# EAGLE schematic amyboard-v1.5 (EAGLE 6.1)
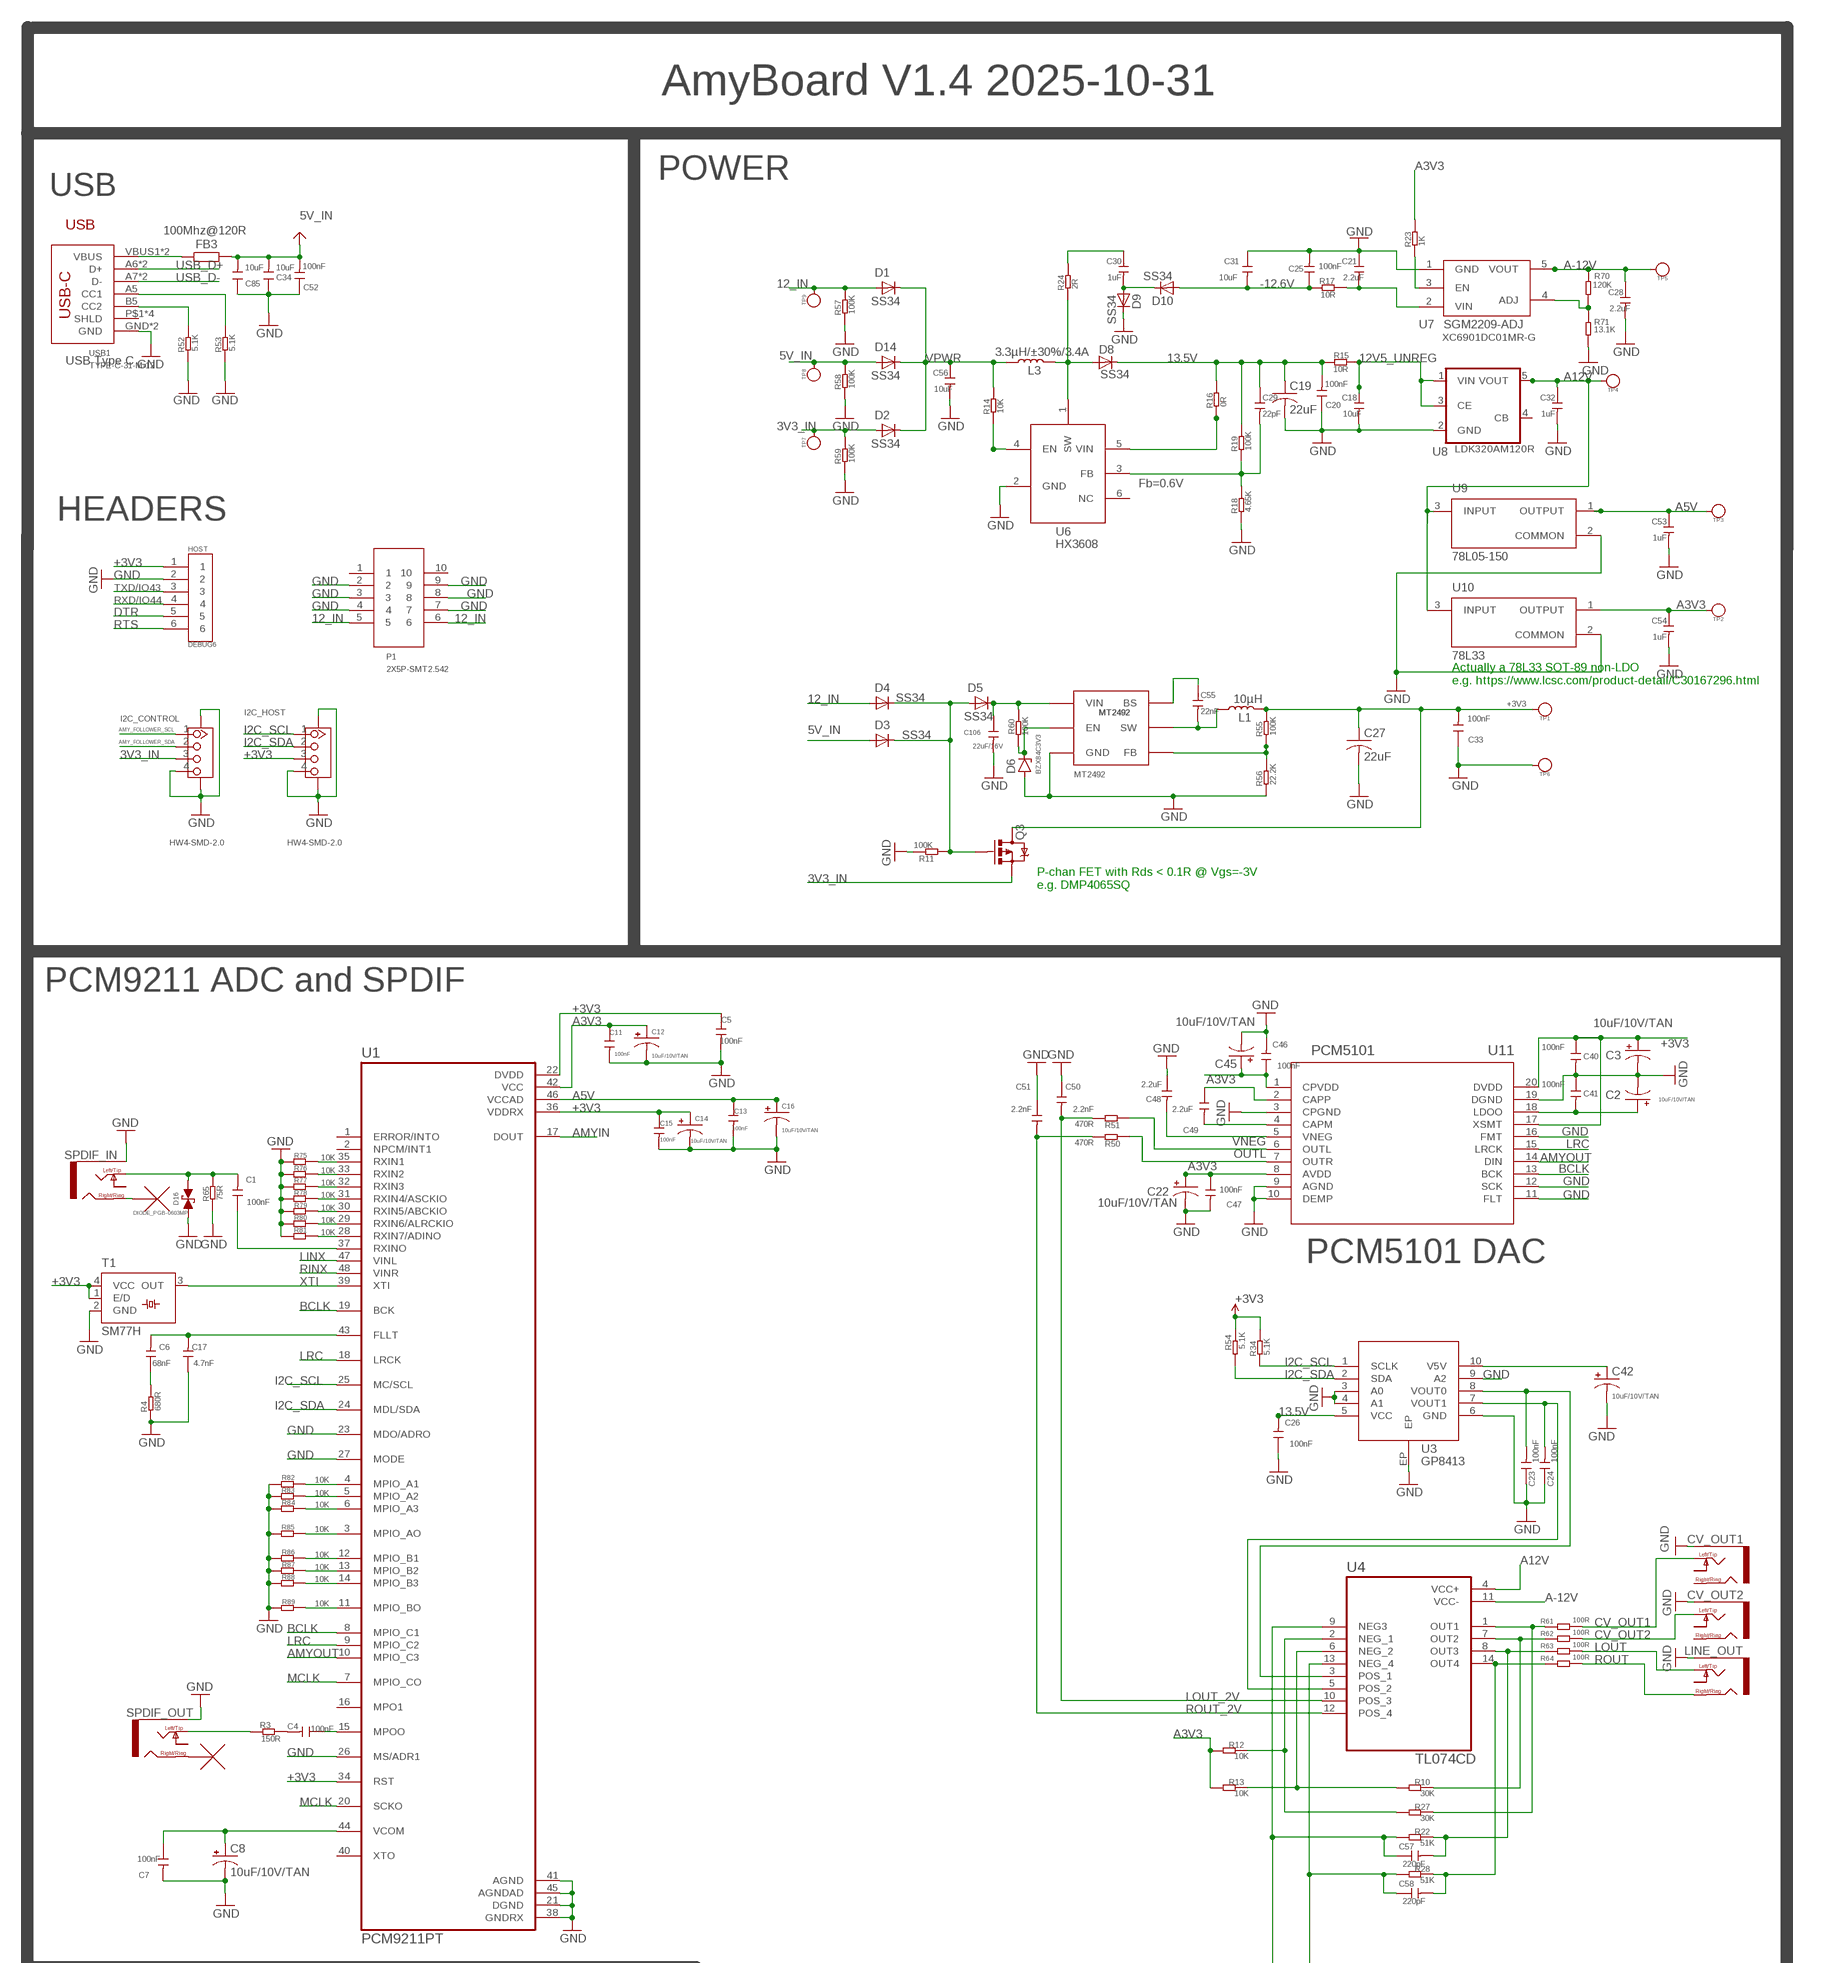
[diagram p0: schematic, sheet 1, part 1 of 2]
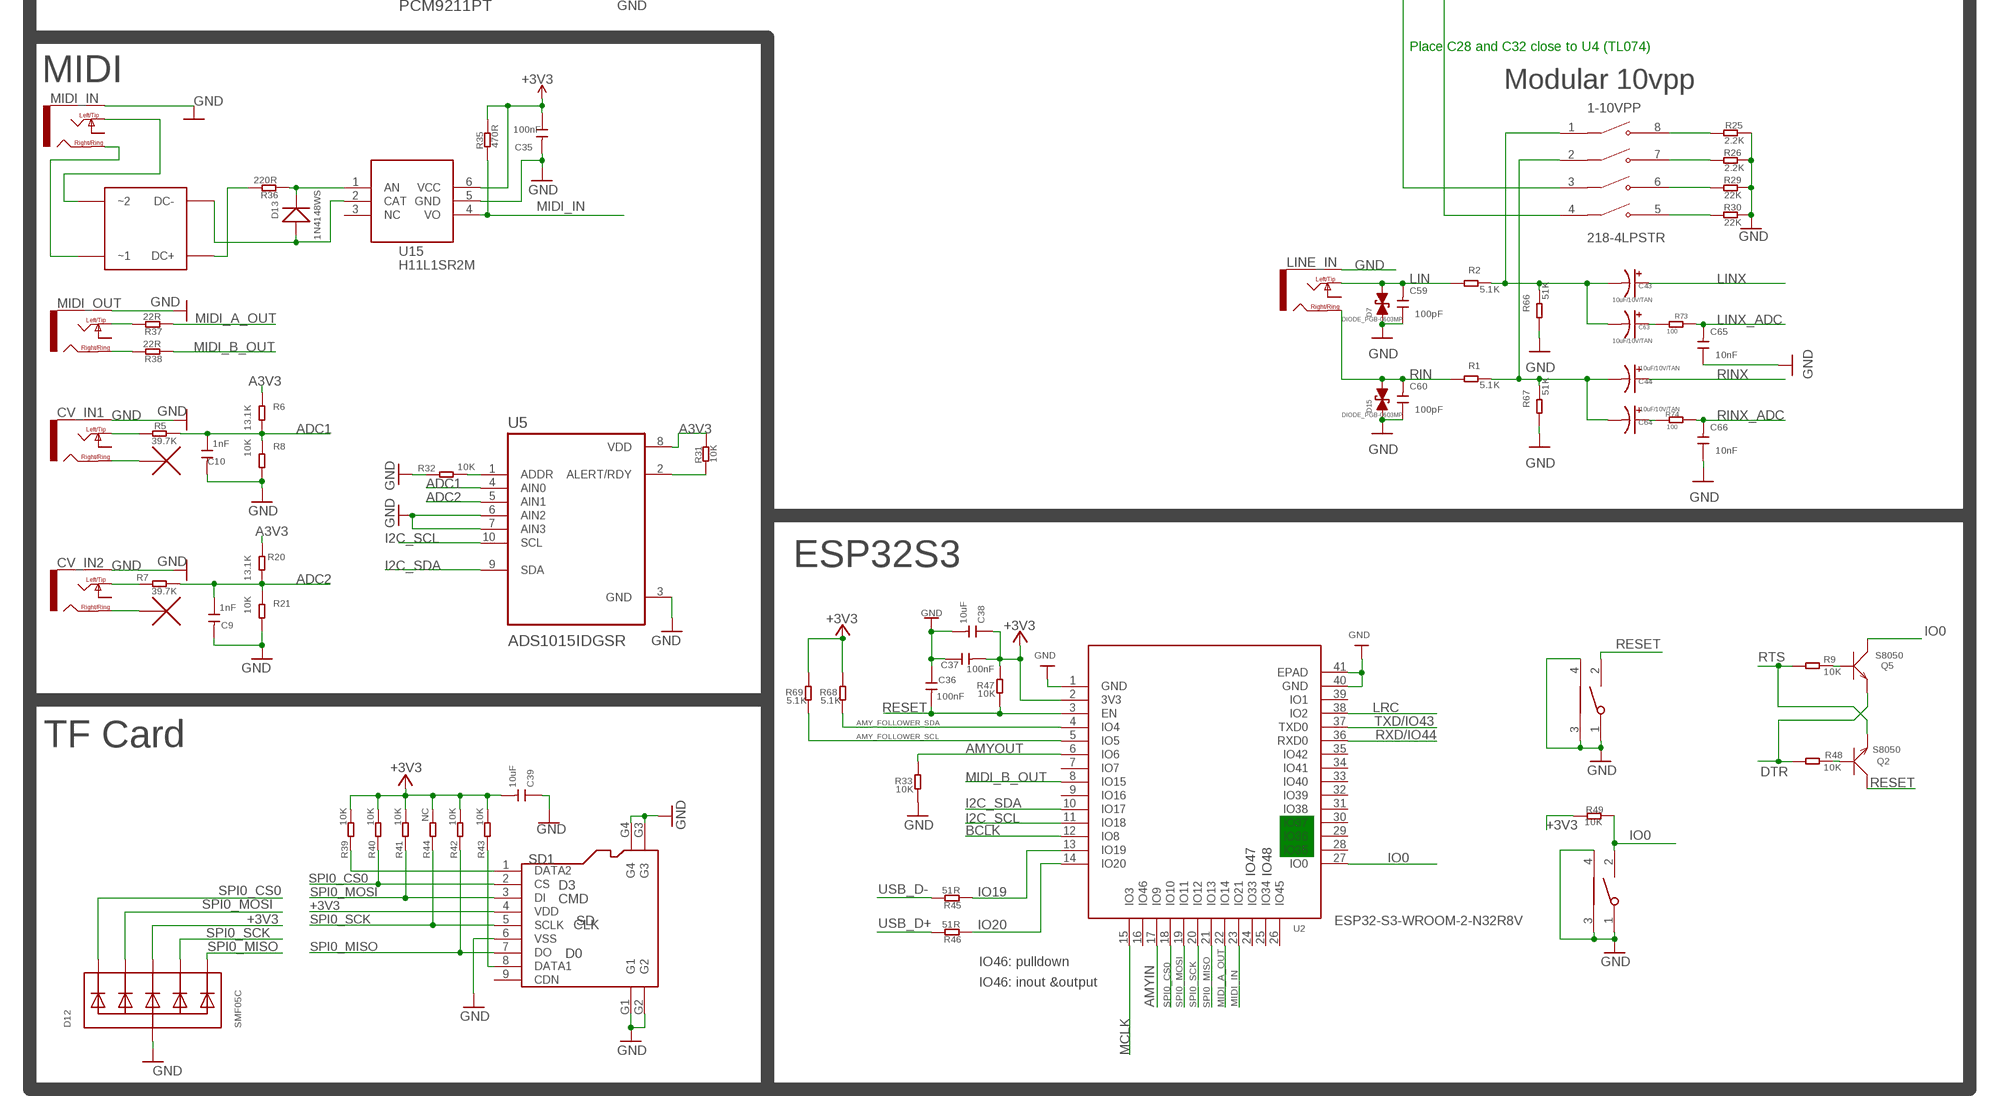
[diagram p1: schematic, sheet 1, part 2 of 2]

## Parts
1-10VPP  218-4LPSTR  [SW_218-4LPSTR]
BOOT  TS24CA  [2*4*3.5MM]
C1  100nF  DISCRETE_C-0402  [DISCRETE_C0402]
C2  10uF/10V/TAN  CPOL-USSMCZ  [SMC_Z]
C3  10uF/10V/TAN  CPOL-USSMCZ  [SMC_Z]
C4  100nF  DISCRETE_C-0402  [DISCRETE_C0402]
C5  100nF  DISCRETE_C-0402  [DISCRETE_C0402]
C6  68nF  DISCRETE_C-0402  [DISCRETE_C0402]
C7  100nF  DISCRETE_C-0402  [DISCRETE_C0402]
C8  10uF/10V/TAN  CPOL-USSMCZ  [SMC_Z]
C9  1nF  DISCRETE_C-0402  [DISCRETE_C0402]
C10  1nF  DISCRETE_C-0402  [DISCRETE_C0402]
C11  100nF  DISCRETE_C-0402  [DISCRETE_C0402]
C12  10uF/10V/TAN  CPOL-USSMCZ  [SMC_Z]
C13  100nF  DISCRETE_C-0402  [DISCRETE_C0402]
C14  10uF/10V/TAN  CPOL-USSMCZ  [SMC_Z]
C15  100nF  DISCRETE_C-0402  [DISCRETE_C0402]
C16  10uF/10V/TAN  CPOL-USSMCZ  [SMC_Z]
C17  4.7nF  DISCRETE_C-0402  [DISCRETE_C0402]
C18  10uF  CAP-0603  [C0603]
C19  22uF  C-USC1206  [C1206]
C20  100nF  DISCRETE_C-0402  [DISCRETE_C0402]
C21  2.2uF  CAP-0603  [C0603]
C22  10uF/10V/TAN  CPOL-USSMCZ  [SMC_Z]
C23  100nF  DISCRETE_C-0402  [DISCRETE_C0402]
C24  100nF  DISCRETE_C-0402  [DISCRETE_C0402]
C25  100nF  DISCRETE_C-0402  [DISCRETE_C0402]
C26  100nF  DISCRETE_C-0402  [DISCRETE_C0402]
C27  22uF  C-USC1206  [C1206]
C28  2.2uF  CAP-0603  [C0603]
C29  22pF  CAP-0603  [C0603]
C30  1uF  CAP-0603  [C0603]
C31  10uF  CAP-0603  [C0603]
C32  1uF  CAP-0603  [C0603]
C33  100nF  DISCRETE_C-0402  [DISCRETE_C0402]
C34  10uF  DISCRETE_C-0603  [DISCRETE_C0603]
C35  100nF  DISCRETE_C-0402  [DISCRETE_C0402]
C36  100nF  DISCRETE_C-0402  [DISCRETE_C0402]
C37  100nF  DISCRETE_C-0402  [DISCRETE_C0402]
C38  10uF  DISCRETE_C-0603  [DISCRETE_C0603]
C39  10uF  DISCRETE_C-0603  [DISCRETE_C0603]
C40  100nF  DISCRETE_C-0402  [DISCRETE_C0402]
C41  100nF  DISCRETE_C-0402  [DISCRETE_C0402]
C42  10uF/10V/TAN  CPOL-USSMCZ  [SMC_Z]
C43  10uF/10V/TAN  CPOL-USSMCZ  [SMC_Z]
C44  10uF/10V/TAN  CPOL-USSMCZ  [SMC_Z]
C45  10uF/10V/TAN  CPOL-USSMCZ  [SMC_Z]
C46  100nF  DISCRETE_C-0402  [DISCRETE_C0402]
C47  100nF  DISCRETE_C-0402  [DISCRETE_C0402]
C48  2.2uF  DISCRETE_C-0402  [DISCRETE_C0402]
C49  2.2uF  DISCRETE_C-0402  [DISCRETE_C0402]
C50  2.2nF  DISCRETE_C-0402  [DISCRETE_C0402]
C51  2.2nF  DISCRETE_C-0402  [DISCRETE_C0402]
C52  100nF  DISCRETE_C-0402  [DISCRETE_C0402]
C53  1uF  CAP-0603  [C0603]
C54  1uF  CAP-0603  [C0603]
C55  22nF  CAP-0603  [C0603]
C56  10uF  CAP-0603  [C0603]
C57  220pF  DISCRETE_C-0402  [DISCRETE_C0402]
C58  220pF  DISCRETE_C-0402  [DISCRETE_C0402]
C59  100pF  DISCRETE_C-0402  [DISCRETE_C0402]
C60  100pF  DISCRETE_C-0402  [DISCRETE_C0402]
C63  10uF/10V/TAN  CPOL-USSMCZ  [SMC_Z]
C64  10uF/10V/TAN  CPOL-USSMCZ  [SMC_Z]
C65  10nF  DISCRETE_C-0402  [DISCRETE_C0402]
C66  10nF  DISCRETE_C-0402  [DISCRETE_C0402]
C85  10uF  DISCRETE_C-0603  [DISCRETE_C0603]
C106  22uF/16V  C-0603  [0603]
CV_IN1  NV-PJ3410_STEREO  [NV-PJ3410_SOCKET]
CV_IN2  NV-PJ3410_STEREO  [NV-PJ3410_SOCKET]
CV_OUT1  NV-PJ3410_STEREO  [NV-PJ3410_SOCKET]
CV_OUT2  NV-PJ3410_STEREO  [NV-PJ3410_SOCKET]
D1  SS34  DIODE-DO-214AC  [DO-214AC]
D2  SS34  DIODE-DO-214AC  [DO-214AC]
D3  SS34  DIODE-DO-214AC  [DO-214AC]
D4  SS34  DIODE-DO-214AC  [DO-214AC]
D5  SS34  DIODE-DO-214AC  [DO-214AC]
D6  BZX84C3V3  BZX84CSMD  [TO236]
D7  DIODE_PGB-0603MP  [DIODE_PGB-0603MP]
D8  SS34  DIODE-DO-214AC  [DO-214AC]
D9  SS34  DIODE-DO-214AC  [DO-214AC]
D10  SS34  DIODE-DO-214AC  [DO-214AC]
D12  SMF05C  TVSARRAY_5LANE  [SOT363]
D13  1N4148WS  D'0805'  [SOD323]
D14  SS34  DIODE-DO-214AC  [DO-214AC]
D15  DIODE_PGB-0603MP  [DIODE_PGB-0603MP]
D16  DIODE_PGB-0603MP  [DIODE_PGB-0603MP]
FB3  100Mhz@120R  R-EU_R0805  [R0805]
HOST  DEBUG6  [DEBUG*6]
I2C_CONTROL  HW4-SMD-2.0  GROVE-CONNECTOR-SMD'90D'  [HW4-SMD-2.0-90D]
I2C_HOST  HW4-SMD-2.0  GROVE-CONNECTOR-SMD'90D'  [HW4-SMD-2.0-90D]
L1  10µH  INDUCTOR-CR54-3.3UH  [CR54]
L3  3.3µH/±30%/3.4A  INDUCTOR-CR54-3.3UH  [CR54]
LINE_IN  NV-PJ3410_STEREO  [NV-PJ3410_SOCKET]
LINE_OUT  NV-PJ3410_STEREO  [NV-PJ3410_SOCKET]
MB14F  MB14F  [MBF]
MIDI_IN  NV-PJ3410_STEREO  [NV-PJ3410_SOCKET]
MIDI_OUT  NV-PJ3410_STEREO  [NV-PJ3410_SOCKET]
P1  2X5P-SMT2.542  [2*5P-SMT2.54-HORN]
PCM5101  U11  PCM5101APW  [PW20_TEX]
Q2  S8050  TRANSISTOR-NPN-SOT23  [SOT23]
Q3  DMP4065SQ  MOSFET-PCHANNEL  [SOT23-3]
Q5  S8050  TRANSISTOR-NPN-SOT23  [SOT23]
R1  5.1K  DISCRETE_R-0402  [DISCRETE_R0402]
R2  5.1K  DISCRETE_R-0402  [DISCRETE_R0402]
R3  150R  DISCRETE_R-0402  [DISCRETE_R0402]
R4  680R  DISCRETE_R-0402  [DISCRETE_R0402]
R5  39.7K  DISCRETE_R-0402  [DISCRETE_R0402]
R6  13.1K  DISCRETE_R-0402  [DISCRETE_R0402]
R7  39.7K  DISCRETE_R-0402  [DISCRETE_R0402]
R8  10K  DISCRETE_R-0402  [DISCRETE_R0402]
R9  10K  DISCRETE_R-0402  [DISCRETE_R0402]
R10  30K  DISCRETE_R-0402  [DISCRETE_R0402]
R11  100K  DISCRETE_R-0402  [DISCRETE_R0402]
R12  10K  DISCRETE_R-0402  [DISCRETE_R0402]
R13  10K  DISCRETE_R-0402  [DISCRETE_R0402]
R14  10K  DISCRETE_R-0402  [DISCRETE_R0402]
R15  10R  R-0603  [R0603]
R16  0R  DISCRETE_R-0402  [DISCRETE_R0402]
R17  10R  DISCRETE_R-0402  [DISCRETE_R0402]
R18  4.65K  DISCRETE_R-0402  [DISCRETE_R0402]
R19  100K  DISCRETE_R-0402  [DISCRETE_R0402]
R20  13.1K  DISCRETE_R-0402  [DISCRETE_R0402]
R21  10K  DISCRETE_R-0402  [DISCRETE_R0402]
R22  51K  DISCRETE_R-0402  [DISCRETE_R0402]
R23  1K  DISCRETE_R-0402  [DISCRETE_R0402]
R24  2R  DISCRETE_R-0402  [DISCRETE_R0402]
R25  2.2K  DISCRETE_R-0402  [DISCRETE_R0402]
R26  2.2K  DISCRETE_R-0402  [DISCRETE_R0402]
R27  30K  DISCRETE_R-0402  [DISCRETE_R0402]
R28  51K  DISCRETE_R-0402  [DISCRETE_R0402]
R29  22K  DISCRETE_R-0402  [DISCRETE_R0402]
R30  22K  DISCRETE_R-0402  [DISCRETE_R0402]
R31  10K  DISCRETE_R-0402  [DISCRETE_R0402]
R32  10K  DISCRETE_R-0402  [DISCRETE_R0402]
R33  10K  DISCRETE_R-0402  [DISCRETE_R0402]
R34  5.1K  DISCRETE_R-0402  [DISCRETE_R0402]
R35  470R  DISCRETE_R-0402  [DISCRETE_R0402]
R36  220R  DISCRETE_R-0402  [DISCRETE_R0402]
R37  22R  DISCRETE_R-0402  [DISCRETE_R0402]
R38  22R  DISCRETE_R-0402  [DISCRETE_R0402]
R39  10K  DISCRETE_R-0402  [DISCRETE_R0402]
R40  10K  DISCRETE_R-0402  [DISCRETE_R0402]
R41  10K  DISCRETE_R-0402  [DISCRETE_R0402]
R42  10K  DISCRETE_R-0402  [DISCRETE_R0402]
R43  10K  DISCRETE_R-0402  [DISCRETE_R0402]
R44  NC  DISCRETE_R-0402  [DISCRETE_R0402]
R45  51R  DISCRETE_R-0402  [DISCRETE_R0402]
R46  51R  DISCRETE_R-0402  [DISCRETE_R0402]
R47  10K  DISCRETE_R-0402  [DISCRETE_R0402]
R48  10K  DISCRETE_R-0402  [DISCRETE_R0402]
R49  10K  DISCRETE_R-0402  [DISCRETE_R0402]
R50  470R  DISCRETE_R-0402  [DISCRETE_R0402]
R51  470R  DISCRETE_R-0402  [DISCRETE_R0402]
R52  5.1K  DISCRETE_R-0402  [DISCRETE_R0402]
R53  5.1K  DISCRETE_R-0402  [DISCRETE_R0402]
R54  5.1K  DISCRETE_R-0402  [DISCRETE_R0402]
R55  100K  DISCRETE_R-0402  [DISCRETE_R0402]
R56  22.2K  DISCRETE_R-0402  [DISCRETE_R0402]
R57  100K  DISCRETE_R-0402  [DISCRETE_R0402]
R58  100K  DISCRETE_R-0402  [DISCRETE_R0402]
R59  100K  DISCRETE_R-0402  [DISCRETE_R0402]
R60  100K  DISCRETE_R-0402  [DISCRETE_R0402]
R61  100R  DISCRETE_R-0402  [DISCRETE_R0402]
R62  100R  DISCRETE_R-0402  [DISCRETE_R0402]
R63  100R  DISCRETE_R-0402  [DISCRETE_R0402]
R64  100R  DISCRETE_R-0402  [DISCRETE_R0402]
R65  75R  DISCRETE_R-0402  [DISCRETE_R0402]
R66  51K  DISCRETE_R-0402  [DISCRETE_R0402]
R67  51K  DISCRETE_R-0402  [DISCRETE_R0402]
R68  5.1K  DISCRETE_R-0402  [DISCRETE_R0402]
R69  5.1K  DISCRETE_R-0402  [DISCRETE_R0402]
R70  120K  DISCRETE_R-0402  [DISCRETE_R0402]
R71  13.1K  DISCRETE_R-0402  [DISCRETE_R0402]
R73  100  DISCRETE_R-0402  [DISCRETE_R0402]
R74  100  DISCRETE_R-0402  [DISCRETE_R0402]
R75  10K  DISCRETE_R-0402  [DISCRETE_R0402]
R76  10K  DISCRETE_R-0402  [DISCRETE_R0402]
R77  10K  DISCRETE_R-0402  [DISCRETE_R0402]
R78  10K  DISCRETE_R-0402  [DISCRETE_R0402]
R79  10K  DISCRETE_R-0402  [DISCRETE_R0402]
R80  10K  DISCRETE_R-0402  [DISCRETE_R0402]
R81  10K  DISCRETE_R-0402  [DISCRETE_R0402]
R82  10K  DISCRETE_R-0402  [DISCRETE_R0402]
R83  10K  DISCRETE_R-0402  [DISCRETE_R0402]
R84  10K  DISCRETE_R-0402  [DISCRETE_R0402]
R85  10K  DISCRETE_R-0402  [DISCRETE_R0402]
R86  10K  DISCRETE_R-0402  [DISCRETE_R0402]
R87  10K  DISCRETE_R-0402  [DISCRETE_R0402]
R88  10K  DISCRETE_R-0402  [DISCRETE_R0402]
R89  10K  DISCRETE_R-0402  [DISCRETE_R0402]
RST  TS24CA  [2*4*3.5MM]
SD1  SD  HOLDER-MICROSD-9P  [9P-SMD-W/-RING]
SPDIF_IN  NV-PJ3410_STEREO  [NV-PJ3410_SOCKET]
SPDIF_OUT  NV-PJ3410_STEREO  [NV-PJ3410_SOCKET]
T1  SM77H  [SM77H]
TP1  PAD-TEST-POINT-CIRCLE'3535'  [TP_3535]
TP2  PAD-TEST-POINT-CIRCLE'3535'  [TP_3535]
TP3  PAD-TEST-POINT-CIRCLE'3535'  [TP_3535]
TP4  PAD-TEST-POINT-CIRCLE'3535'  [TP_3535]
TP5  PAD-TEST-POINT-CIRCLE'3535'  [TP_3535]
TP6  PAD-TEST-POINT-CIRCLE'3535'  [TP_3535]
TP7  PAD-TEST-POINT-CIRCLE'3535'  [TP_3535]
TP8  PAD-TEST-POINT-CIRCLE'3535'  [TP_3535]
TP9  PAD-TEST-POINT-CIRCLE'3535'  [TP_3535]
U1  PCM9211PT  [QFP50P900X900X160-48N]
U2  ESP32­S2­SOLO  [ESP32-­S2-­SOLO]
U3  GP8413  [ESOP-10-EP-150MIL]
U4  TL074CD  [SOIC127P600X175-14N]
U5  ADS1015IDGSR  [SOP50P490X110-10N]
U6  HX3608  [SOT-23-6]
U7  SGM2209-ADJ  [SOT-25]
U8  TS5205  [SOT25]
U9  78L05-150  UA78L05ACPKG4  [VREG_UA78L05ACPKG4]
U10  78L33  UA78L05ACPKG4  [VREG_UA78L05ACPKG4]
U12  MT2492  [SOT23-6]
U15  H11L1SR2M  [SOP-6-2.54MM]
U$1  NC_MARKER  (no package)
U$2  NC_MARKER  (no package)
U$5  NC_MARKER  (no package)
U$6  NC_MARKER  (no package)
USB1  TYPE-C-31-M-12  [TYPE-C-31-M-12]

## Nets
3V3_IN: D2.A I2C_CONTROL.3 Q3.2(S) R59.1 TP7.T
5V_IN: C34.2 C52.2 C85.2 D3.A D14.A FB3.2 R58.1 TP8.T ; supply symbol labelled VBUS
12_IN: D1.A D4.A P1.5 P1.6 R57.1 TP9.T
12V5_UNREG: C18.1 R15.1 U8.1(VIN) U8.3(CE)
13.5V: C19.1 C20.2 C26.2 C29.1 D8.C R15.2 R16.1 R19.1 U3.5(VCC)
+3V3: C3.+ C5.1 C14.+ C15.1 C27.1 C33.2 C35.1 C37.2 C38.1 C39.2 C40.1 D12.4(C3) HOST.1 I2C_HOST.3 L1.P$2 PCM5101.17(XSMT) PCM5101.20(DVDD) Q3.3(D) R34.1 R35.1 R39.2 R40.2 R41.2 R42.2 R43.2 R44.2 R47.2 R49.2 R54.1 R55.1 R68.2 R69.2 SD1.4(VDD) T1.1(E/D) T1.4(VCC) TP1.T U1.22(DVDD) U1.34(RST) U1.36(VDDRX) U2.2(3V3) U15.6(VCC)
-12.6V: C25.1 C31.2 D10.A R17.2
A3V3: C11.1 C12.+ C22.+ C45.+ C46.1 C47.1 C54.1 PCM5101.1(CPVDD) PCM5101.8(AVDD) R6.2 R12.2 R13.2 R20.2 R23.1 R31.1 TP2.T U1.42(VCC) U5.8(VDD) U10.1(OUTPUT)
A5V: C13.1 C16.+ C53.1 TP3.T U1.46(VCCAD) U9.1(OUTPUT)
A12V: C32.1 TP4.T U4.4(VCC+) U8.5(VOUT) U9.3(INPUT) U10.3(INPUT)
A-12V: C28.1 R70.1 TP5.T U4.11(VCC-) U7.5(VOUT)
ADC1: C10.1 R5.1 R6.1 R8.2 U5.4(AIN0)
ADC2: C9.1 R7.1 R20.1 R21.2 U5.5(AIN1)
AMY_FOLLOWER_SCL: I2C_CONTROL.1 R69.1 U2.5(IO5)
AMY_FOLLOWER_SDA: I2C_CONTROL.2 R68.1 U2.4(IO4)
AMYIN: U1.17(DOUT) U2.17(IO9)
AMYOUT: PCM5101.14(DIN) R33.2 U1.10(MPIO_C3) U2.6(IO6)
BCLK: PCM5101.13(BCK) U1.8(MPIO_C1) U1.19(BCK) U2.12(IO8)
CV_OUT1: CV_OUT1.LEFT/TIP(TIP) R61.1
CV_OUT2: CV_OUT2.LEFT/TIP(TIP) R62.1
DTR: HOST.5 Q5.2(E) R48.2
ENABLE: R14.2 U6.4(EN)
GND: BOOT.1 BOOT.3 BOOT.4 C2.- C3.- C5.2 C7.2 C8.- C9.2 C10.2 C11.2 C12.- C13.2 C14.- C15.2 C16.- C17.1 C18.2 C19.2 C20.1 C21.1 C22.- C23.1 C24.1 C25.2 C26.1 C27.2 C28.2 C31.1 C32.2 C33.1 C34.1 C35.2 C36.1 C37.1 C38.2 C39.1 C40.2 C41.1 C42.- C45.- C46.2 C47.2 C48.1 C50.1 C51.1 C52.1 C53.2 C54.2 C56.2 C59.1 C60.1 C65.1 C66.1 C85.1 C106.2 CV_IN1.GND(EARTH) CV_IN2.GND(EARTH) CV_OUT1.GND(EARTH) CV_OUT2.GND(EARTH) D6.A D7.1 D9.C D12.2(A) D15.1 D16.1 HOST.2 I2C_CONTROL.4 I2C_CONTROL.SS1 I2C_CONTROL.SS2 I2C_HOST.4 I2C_HOST.SS1 I2C_HOST.SS2 LINE_IN.GND(EARTH) LINE_OUT.GND(EARTH) MIDI_IN.GND(EARTH) MIDI_OUT.GND(EARTH) P1.2 P1.3 P1.4 P1.7 P1.8 P1.9 PCM5101.3(CPGND) PCM5101.9(AGND) PCM5101.10(DEMP) PCM5101.11(FLT) PCM5101.12(SCK) PCM5101.16(FMT) PCM5101.19(DGND) R4.2 R8.1 R11.1 R18.2 R21.1 R25.1 R26.1 R29.1 R30.1 R32.1 R33.1 R52.2 R53.2 R56.2 R57.2 R58.2 R59.2 R65.2 R66.2 R67.2 R71.2 R75.2 R76.2 R77.2 R78.2 R79.2 R80.2 R81.2 R82.2 R83.2 R84.2 R85.2 R86.2 R87.2 R88.2 R89.2 RST.1 RST.3 RST.4 SD1.6(VSS) SD1.G1 SD1.G2 SD1.G3 SD1.G4 SPDIF_IN.GND(EARTH) SPDIF_OUT.GND(EARTH) T1.2(GND) TP6.T U1.21(DGND) U1.23(MDO/ADRO) U1.26(MS/ADR1) U1.27(MODE) U1.38(GNDRX) U1.41(AGND) U1.45(AGNDAD) U2.1(GND) U2.40(GND) U2.41(EPAD) U3.3(A0) U3.4(A1) U3.6(GND) U3.9(A2) U3.EP U5.3(GND) U5.6(AIN2) U5.7(AIN3) U6.2(GND) U7.1(GND) U8.2(GND) U9.2(COMMON) U10.2(COMMON) U12.2(GND) U15.5(GND) USB1.GND USB1.GND2(GND)
I2C_SCL: I2C_HOST.1 R34.2 U1.25(MC/SCL) U2.11(IO18) U3.1(SCLK) U5.10(SCL)
I2C_SDA: I2C_HOST.2 R54.2 U1.24(MDL/SDA) U2.10(IO17) U3.2(SDA) U5.9(SDA)
IO0: BOOT.2 Q5.3(C) R49.1 U2.27(IO0)
IO19: R45.2 U2.13(IO19)
IO20: R46.2 U2.14(IO20)
LIN: C59.2 D7.2 LINE_IN.LEFT/TIP(TIP) R2.2
LINX: C43.+ U1.47(VINL)
LINX_ADC: C65.2 R73.1
LOUT: LINE_OUT.LEFT/TIP(TIP) R63.1
LOUT_2V: C50.2 R51.1 U4.10(POS_3)
LRC: PCM5101.15(LRCK) U1.9(MPIO_C2) U1.18(LRCK) U2.38(IO2)
MCLK: U1.7(MPIO_CO) U1.20(SCKO) U2.15(IO3)
MIDI_A_OUT: R37.2 U2.22(IO14)
MIDI_B_OUT: R38.2 U2.8(IO15)
MIDI_IN: R35.2 U2.23(IO21) U15.4(VO)
N$1: C1.1 U1.37(RXINO)
N$2: C4.2 R3.1
N$3: C4.1 U1.15(MPOO)
N$4: 1-10VPP.1 C43.- C63.- R2.1 R66.1
N$5: 1-10VPP.2 C44.- C64.- R1.1 R67.1
N$6: C7.1 C8.+ U1.44(VCOM)
N$7: C6.2 C17.2 U1.43(FLLT)
N$8: C6.1 R4.1
N$9: SPDIF_OUT.RIGHT/RING(RING) U$1.P$1
N$10: SPDIF_IN.RIGHT/RING(RING) U$2.P$1
N$11: R70.2 R71.1 U7.4(ADJ)
N$13: CV_IN2.LEFT/TIP(TIP) R7.2
N$14: CV_IN2.RIGHT/RING(RING) U$6.P$1
N$15: C21.2 R17.1 U7.2(VIN)
N$16: D13.+ MB14F.DCMINUS(DC-) U15.2(CAT)
N$17: CV_IN1.RIGHT/RING(RING) U$5.P$1
N$18: C23.2 U3.8(VOUT0) U4.3(POS_1)
N$19: CV_IN1.LEFT/TIP(TIP) R5.2
N$20: C24.2 U3.7(VOUT1) U4.5(POS_2)
N$21: D8.A L3.P$2 R24.2 U6.1(SW)
N$22: C42.+ U3.10(V5V)
N$23: D3.C D4.C D5.A Q3.1(G) R11.2
N$24: C106.1 D5.C R60.1 U12.5(VIN)
N$25: C55.2 L1.P$1 U12.6(SW)
N$26: R10.1 R62.2 U4.7(OUT2)
N$27: C30.1 R24.1
N$28: R16.2 U6.5(VIN)
N$29: C30.2 D9.A D10.C
N$30: R23.2 U7.3(EN)
N$31: R10.2 R13.1 U4.6(NEG_2)
N$32: R27.1 R61.2 U4.1(OUT1)
N$33: R12.1 R27.2 U4.2(NEG_1)
N$34: Q2.1(B) R48.1
N$35: 1-10VPP.5 R30.2
N$36: 1-10VPP.6 R29.2
N$37: Q5.1(B) R9.1
N$38: R53.1 USB1.A5(CC1)
N$39: R52.1 USB1.B5(CC2)
N$40: 1-10VPP.8 R25.2
N$41: 1-10VPP.7 R26.2
N$42: FB3.1 USB1.VBUS1(VBUS) USB1.VBUS2(VBUS)
N$43: R31.2 U5.2(ALERT/RDY)
N$44: 1-10VPP.3 C57.1 R22.2 U4.9(NEG3)
N$45: 1-10VPP.4 C58.1 R28.2 U4.13(NEG_4)
N$46: R32.2 U5.1(ADDR)
N$47: R55.2 R56.1 U12.3(FB)
N$48: C2.+ C41.2 PCM5101.18(LDOO)
N$49: MB14F.DCPLUS(DC+) R36.1
N$50: PCM5101.7(OUTR) R50.2
N$51: C49.2 PCM5101.4(CAPM)
N$52: C49.1 PCM5101.2(CAPP)
N$53: C55.1 U12.1(BS)
N$54: MB14F.AC1(~1) MIDI_IN.RIGHT/RING(RING)
N$55: MB14F.AC2(~2) MIDI_IN.LEFT/TIP(TIP)
N$56: D6.C R60.2 U12.4(EN)
N$57: D13.- R36.2 U15.1(AN)
N$58: MIDI_OUT.LEFT/TIP(TIP) R37.1
N$59: MIDI_OUT.RIGHT/RING(RING) R38.1
N$60: C29.2 R18.1 R19.2 U6.3(FB)
N$61: C58.2 R28.1 R64.2 U4.14(OUT4)
N$63: C57.2 R22.1 R63.2 U4.8(OUT3)
N$67: R75.1 U1.35(RXIN1)
N$68: R76.1 U1.33(RXIN2)
N$69: C63.+ R73.2
N$70: C64.+ R74.2
N$75: R39.1 SD1.1(DATA2)
N$76: R77.1 U1.32(RXIN3)
N$77: R43.1 SD1.8(DATA1)
N$78: R78.1 U1.31(RXIN4/ASCKIO)
N$79: R79.1 U1.30(RXIN5/ABCKIO)
N$80: R80.1 U1.29(RXIN6/ALRCKIO)
N$81: R81.1 U1.28(RXIN7/ADINO)
N$82: R82.1 U1.4(MPIO_A1)
N$83: R83.1 U1.5(MPIO_A2)
N$84: R84.1 U1.6(MPIO_A3)
N$85: R85.1 U1.3(MPIO_AO)
N$86: R86.1 U1.12(MPIO_B1)
N$87: R87.1 U1.13(MPIO_B2)
N$88: R88.1 U1.14(MPIO_B3)
N$89: R89.1 U1.11(MPIO_BO)
OUTL: PCM5101.6(OUTL) R51.2
RESET: C36.2 Q2.3(C) R47.1 RST.2 U2.3(EN)
RIN: C60.2 D15.2 LINE_IN.RIGHT/RING(RING) R1.2
RINX: C44.+ U1.48(VINR)
RINX_ADC: C66.2 R74.1
ROUT: LINE_OUT.RIGHT/RING(RING) R64.1
ROUT_2V: C51.2 R50.1 U4.12(POS_4)
RTS: HOST.6 Q2.2(E) R9.2
RXD/IO44: HOST.4 U2.36(RXD0)
SPDIFIN_SIGNAL: C1.2 D16.2 R65.1 SPDIF_IN.LEFT/TIP(TIP)
SPDIFOUT_SIGNAL: R3.2 SPDIF_OUT.LEFT/TIP(TIP)
SPI0_CS0: D12.1(C1) R40.1 SD1.2(CS) U2.18(IO10)
SPI0_MISO: D12.6(C5) R42.1 SD1.7(DO) U2.21(IO13)
SPI0_MOSI: D12.3(C2) R41.1 SD1.3(DI) U2.19(IO11)
SPI0_SCK: D12.5(C4) R44.1 SD1.5(SCLK) U2.20(IO12)
TXD/IO43: HOST.3 U2.37(TXD0)
USB_D+: R46.1 USB1.A6(D+) USB1.B6(D+)
USB_D-: R45.1 USB1.A7(D-) USB1.B7(D-)
VNEG: C48.2 PCM5101.5(VNEG)
VPWR: C56.1 D1.C D2.C D14.C L3.P$1 R14.1
XTI: T1.3(OUT) U1.39(XTI)
Unconnected: CV_IN1.SWITCH(TIP-NORM) CV_IN2.SWITCH(TIP-NORM) CV_OUT1.RIGHT/RING(RING) CV_OUT1.SWITCH(TIP-NORM) CV_OUT2.RIGHT/RING(RING) CV_OUT2.SWITCH(TIP-NORM) LINE_IN.SWITCH(TIP-NORM) LINE_OUT.SWITCH(TIP-NORM) MIDI_IN.SWITCH(TIP-NORM) MIDI_OUT.SWITCH(TIP-NORM) P1.1 P1.10 SD1.9(CDN) SPDIF_IN.SWITCH(TIP-NORM) SPDIF_OUT.SWITCH(TIP-NORM) U1.1(ERROR/INTO) U1.2(NPCM/INT1) U1.16(MPO1) U1.40(XTO) U2.7(IO7) U2.9(IO16) U2.16(IO46) U2.24(IO33) U2.25(IO34) U2.26(IO45) U2.28(IO35) U2.29(IO36) U2.30(IO37) U2.31(IO38) U2.32(IO39) U2.33(IO40) U2.34(IO41) U2.35(IO42) U2.39(IO1) U6.6(NC) U8.4(CB) U15.3(NC) USB1.P$1(SHLD) USB1.P$2(SHLD) USB1.P$3(SHLD) USB1.P$4(SHLD)

## Notes on the sheet
- AmyBoard V1.4 2025-10-31
- POWER
- USB
- USB
- XC6901DC01MR-G
- USB Type C
- LDK320AM120R
- Fb=0.6V
- HEADERS
- Actually a 78L33 SOT-89 non-LDO 
  e.g. https://www.lcsc.com/product-detail/C30167296.html
- P-chan FET with Rds < 0.1R @ Vgs=-3V
  e.g. DMP4065SQ
- PCM9211 ADC and SPDIF
- PCM5101 DAC
- Place C28 and C32 close to U4 (TL074)
- MIDI | Modular 10vpp
- ESP32S3
- TF Card
- IO47 | IO48
- D3
- CMD
- ESP32-S3-WROOM-2-N32R8V
- CLK
- D0
- IO46: pulldown
- IO46: inout &output

## Library data of the parts
1-10VPP = 218-4LPSTR:218-4LPSTR: Check availability <https://pricing.snapeda.com/parts/218-4LPSTR/CTS%20Electrocomponents/view-part?ref=eda>; AVAILABILITY: In Stock; CHECK_PRICES: https://www.snapeda.com/parts/218-4LPSTR/CTS+Components/view-part/?ref=eda; DESCRIPTION: Dip Switch SPST 4 Position Surface Mount Slide (Standard) Actuator 25mA 24VDC; MF: CTS Electrocomponents; MP: 218-4LPSTR; PACKAGE: None; PRICE: None; SNAPEDA_LINK: https://www.snapeda.com/parts/218-4LPSTR/CTS+Components/view-part/?ref=snap
BOOT RST = sale:TS24CA
C1 C4-C7 C9-C11 C13 C15 C17 C20 C23-C26 C33-C41 C46-C52 C57-C60 C65 C66 C85 = A9G:DISCRETE_C*: Ceramic Capacitors
C2 C3 C8 C12 C14 C16 C22 C42-C45 C63 C64 = rcl:CPOL-US: POLARIZED CAPACITOR, American symbol
C18 C21 C28-C32 C53-C56 = Discrete-new:CAP: Ceramic Capacitors
C19 C27 = adafruit:C-US: CAPACITOR, American symbol
C106 = Discrete:C*: Ceramic Capacitors
CV_IN1 CV_IN2 CV_OUT1 CV_OUT2 LINE_IN LINE_OUT MIDI_IN MIDI_OUT SPDIF_IN SPDIF_OUT = PJ3410_sockets:NV-PJ3410_STEREO: PJ3410 socket stereo with switch
D1-D5 D8-D10 D14 = diode:DIODE-: DIODE
D6 = diode@1:BZX84CSMD: Z DIODE
D7 D15 D16 = 52101-101-REV-A_v16:DIODE_PGB-0603: ESD SUPPRESSOR
D12 = microbuilder:TVSARRAY_5LANE: Voltage Transient Suppressor Array SOT363 SMF05C - 100W 5V: Digikey - SMF05CT1GOSCT-ND
D13 = Discrete:D*
FB3 = rcl:R-EU_: RESISTOR, European symbol
HOST = Makerfabs-Peter:DEBUG*6
I2C_CONTROL I2C_HOST = Connector-new:GROVE-CONNECTOR-SMD: 4P-SMD-2.0:320110030;4P-SMD-2.0-90D:320110032
L1 = SparkFun-Coils:INDUCTOR: Inductors Resist changes in electrical current. Basically a coil of wire. SparkFun Products: SparkFun Load Cell Amplifier - HX711 <https://www.sparkfun.com/products/13879> IOIO-OTG - V2.2 <https://www.sparkfun.com/products/13613>; PROD_ID: NDUC-11157; VALUE: 3.3µH/±30%/3.4A
L3 = SparkFun-Coils:INDUCTOR: Inductors Resist changes in electrical current. Basically a coil of wire. SparkFun Products: SparkFun Load Cell Amplifier - HX711 <https://www.sparkfun.com/products/13879> IOIO-OTG - V2.2 <https://www.sparkfun.com/products/13613>; PROD_ID: NDUC-11157
MB14F = dpwe:MB14F: MB14F Bridge Rectifier 1A 40V https://www.lcsc.com/datasheet/lcsc_datasheet_2410121530_GOODWORK-MB14F_C2943867.pdf
P1 = sale:2X5P-SMT2.54
PCM5101 = pcm5101apw:PCM5101APW; COPYRIGHT: Copyright (C) 2022 Ultra Librarian. All rights reserved.; DIGI-KEY_PART_NUMBER_1: PCM5101APW-ND; MANUFACTURER_PART_NUMBER: PCM5101APW; MFR_NAME: Texas Instruments
Q2 Q5 = Discrete:TRANSISTOR-NPN*: NPN audion
Q3 = User-Submitted:MOSFET-PCHANNEL: Generic PMOSFET IRLML2244 - TRANS-11153 (SOT-23 -20V -4.3A) (1.Gate 2.Source 3.Drain) FQP27P06 - COM-10349 <http://www.sparkfun.com/products/10349> (TO-220 -60V -27A) (1.Gate 2.Source 3.Drain); PROD_ID: TRANS-08285
R1-R14 R16-R71 R73-R89 = A9G:DISCRETE_R*
R15 = Discrete:R*
SD1 = Connector:HOLDER-MICROSD-9P
T1 = crystal:SM77H: 3.3V CMOS Clock Oscillator Source: www.pletronics.com .. sm77h%203.3v.pdf; OC_FARNELL: unknown; OC_NEWARK: unknown
TP1-TP9 = Discrete:PAD-TEST-POINT-CIRCLE; PARTNO: DNP
U1 = PCM9211PT:PCM9211PT: Check availability <https://pricing.snapeda.com/parts/PCM9211PT/Texas%20Instruments/view-part?ref=eda>; AVAILABILITY: In Stock; CHECK_PRICES: https://www.snapeda.com/parts/PCM9211PT/Texas+Instruments/view-part/?ref=eda; DESCRIPTION: 216kHz Digital Audio Interface Transceiver (DIX) with Stereo ADC and Routing; MF: Texas Instruments; MP: PCM9211PT; PACKAGE: LQFP-48 Texas Instruments; PRICE: None; SNAPEDA_LINK: https://www.snapeda.com/parts/PCM9211PT/Texas+Instruments/view-part/?ref=snap
U2 = self:ESP32­S2­SOLO
U3 = sale:GP8413
U4 = TL074CD:TL074CD: Check availability <https://pricing.snapeda.com/parts/TL074CD/Texas%20Instruments/view-part?ref=eda>; AVAILABILITY: In Stock; CHECK_PRICES: https://www.snapeda.com/parts/TL074CD/Texas+Instruments/view-part/?ref=eda; DESCRIPTION: Quad, 30-V, 3-MHz, high slew rate (13-V/µs), In to V+, JFET-input op amp; MF: Texas Instruments; MP: TL074CD; PACKAGE: SOIC-14 Texas Instruments; PRICE: None; SNAPEDA_LINK: https://www.snapeda.com/parts/TL074CD/Texas+Instruments/view-part/?ref=snap
U5 = ADS1015IDGSR:ADS1015IDGSR: Check availability <https://pricing.snapeda.com/parts/ADS1015IDGSR/Texas%20Instruments/view-part?ref=eda>; AVAILABILITY: In Stock; CHECK_PRICES: https://www.snapeda.com/parts/ADS1015IDGSR/Texas+Instruments/view-part/?ref=eda; DESCRIPTION: 12-bit, 3.3-kSPS, 4-channel, delta-sigma ADC with PGA, oscillator, VREF, comparator and I2C; MF: Texas Instruments; MP: ADS1015IDGSR; PACKAGE: VSSOP-10 Texas Instruments; PRICE: None; SNAPEDA_LINK: https://www.snapeda.com/parts/ADS1015IDGSR/Texas+Instruments/view-part/?ref=snap
U6 = self:HX3608
U7 = Makerfabs-Peter:SGM2209-ADJ
U8 = v-reg:TS5205: 150mA Low Noise LDO Voltage Regulator with Enable TSC [Taiwan Semiconductor Company, Ltd] Source: http://www.taiwansemi.com .. 5205_0409c.pdf
U9 U10 = UA78L05ACPKG4:UA78L05ACPKG4: Check availability <https://pricing.snapeda.com/parts/UA78L05ACPKG4/Texas%20Instruments/view-part?ref=eda>; AVAILABILITY: Not in stock; CHECK_PRICES: https://www.snapeda.com/parts/UA78L05ACPKG4/Texas+Instruments/view-part/?ref=eda; DESCRIPTION: V REG 0.1A +5.0V, 78L05, SOT-89-3; Voltage Regulator Type: Fixed; Voltage, Input Max: 20V; Voltage, Output Max: 5V; O...; MF: Texas Instruments; MP: UA78L05ACPKG4; PACKAGE: SOT-89-3 Texas Instruments; PRICE: None; SNAPEDA_LINK: https://www.snapeda.com/parts/UA78L05ACPKG4/Texas+Instruments/view-part/?ref=snap
U12 = dpwe:MT2492: MT2492 600KHz, 16V，2A Synchronous Step-Down Converter https://www.lcsc.com/datasheet/lcsc_datasheet_2408140941_XI-AN-Aerosemi-Tech-MT2492_C89358.pdf
U15 = sale:H11L1SR2M
U$1 U$2 U$5 U$6 = NC_MARKER:NC_MARKER
USB1 = sale:TYPE-C-31-M-12

## Net classes
0 default: width 0.203 mm